# EAGLE design control board (EAGLE 9.6.0)
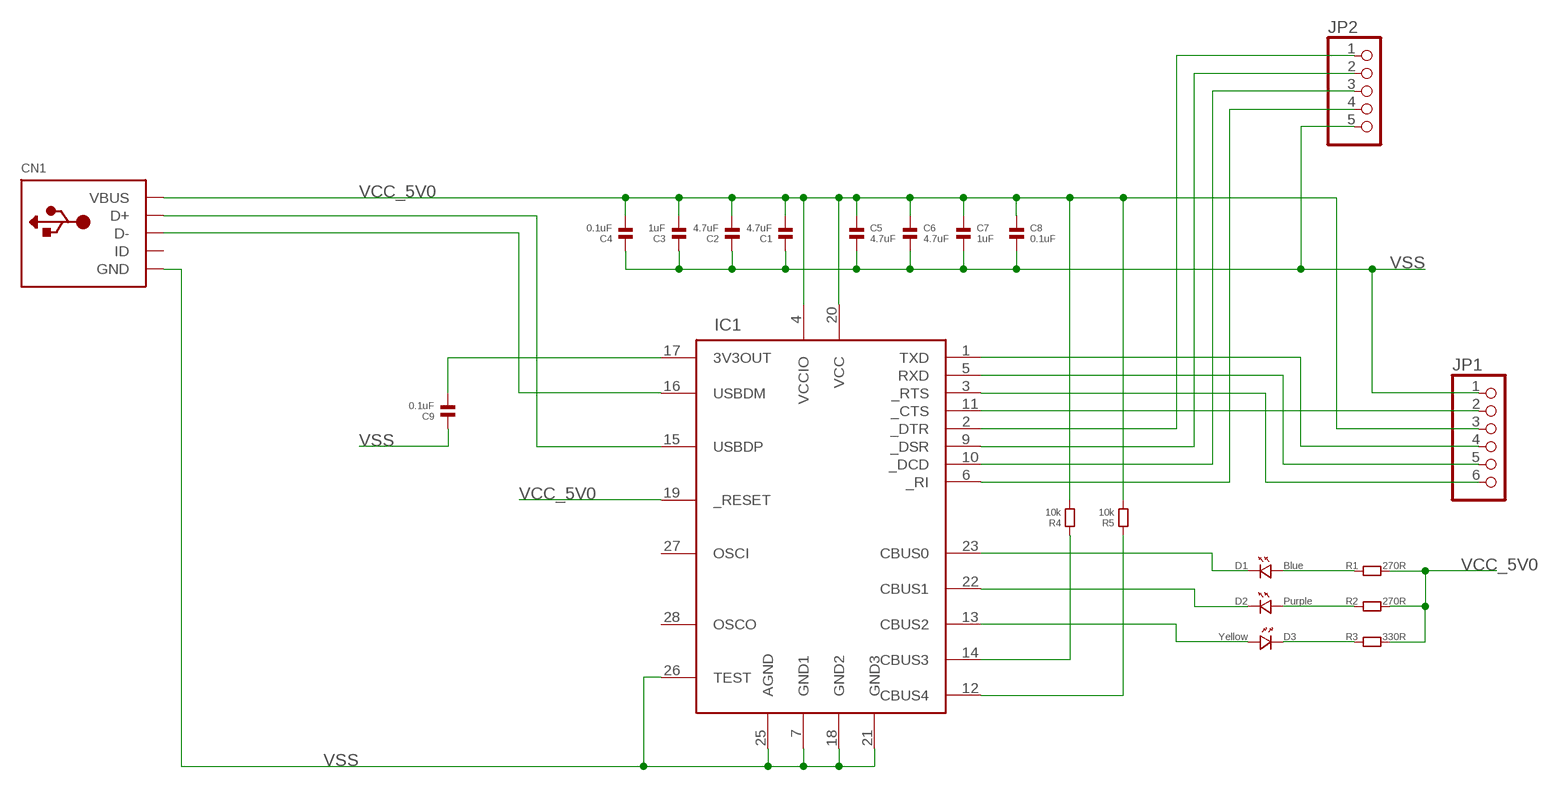
[diagram p0: schematic, sheet 1]

## Parts
C1  4.7uF  CAPACITOR.0603  [0603]
C2  4.7uF  CAPACITOR.0603  [0603]
C3  1uF  CAPACITOR.0603  [0603]
C4  0.1uF  CAPACITOR.0603  [0603]
C5  4.7uF  CAPACITOR.0603  [0603]
C6  4.7uF  CAPACITOR.0603  [0603]
C7  1uF  CAPACITOR.0603  [0603]
C8  0.1uF  CAPACITOR.0603  [0603]
C9  0.1uF  CAPACITOR.0603  [0603]
CN1  USBMINIB  [USB-MINIB]
D1  Blue  LED.0603  [0603.LED]
D2  Purple  LED.0603  [0603.LED]
D3  Yellow  LED.0603  [0603.LED]
IC1  FT232RL  [SSOP28DB]
JP1  PINHD-1X6  [1X06]
JP2  PINHD-1X5  [1X05]
R1  270R  RESISTOR.0603  [0603]
R2  270R  RESISTOR.0603  [0603]
R3  330R  RESISTOR.0603  [0603]
R4  10k  RESISTOR.0603  [0603]
R5  10k  RESISTOR.0603  [0603]

## Nets
N$1: CN1.D- IC1.16(USBDM)
N$2: CN1.D+ IC1.15(USBDP)
N$3: IC1.11(_CTS) JP1.2
N$4: IC1.1(TXD) JP1.4
N$5: IC1.5(RXD) JP1.5
N$6: IC1.3(_RTS) JP1.6
N$7: D1.P$2 IC1.23(CBUS0)
N$8: D2.P$2 IC1.22(CBUS1)
N$9: D2.P$1 R2.1
N$10: D1.P$1 R1.1
N$11: D3.P$1 IC1.13(CBUS2)
N$12: IC1.14(CBUS3) R4.1
N$13: IC1.12(CBUS4) R5.1
N$14: D3.P$2 R3.1
N$15: IC1.6(_RI) JP2.4
N$16: C9.2 IC1.17(3V3OUT)
N$17: IC1.10(_DCD) JP2.3
N$18: IC1.9(_DSR) JP2.2
N$19: IC1.2(_DTR) JP2.1
VCC_5V0: C1.2 C2.2 C3.2 C4.2 C5.1 C6.1 C7.1 C8.1 CN1.VBUS IC1.4(VCCIO) IC1.19(_RESET) IC1.20(VCC) JP1.3 R1.2 R2.2 R3.2 R4.2 R5.2
VSS: C1.1 C2.1 C3.1 C4.1 C5.2 C6.2 C7.2 C8.2 C9.1 CN1.GND IC1.7(GND1) IC1.18(GND2) IC1.21(GND3) IC1.25(AGND) IC1.26(TEST) JP1.1 JP2.5
Unconnected: CN1.ID IC1.27(OSCI) IC1.28(OSCO)

## Library data of the parts
C1-C9 = standardparts:CAPACITOR
CN1 = adafruit:USB: USB Connectors USBMINIB - Surface Mount Female Mini-B USB Connector 4UConnector: 06564 By microbuilder.eu Thru-hole RA Female Mini-B USB Connector 4UConnector: 18732 By ladyada.net
D1-D3 = standardparts:LED
IC1 = ftdichip-1:FT232RL: USB UART 4th Generation USB UART (USB <-> Serial) Controller
JP1 = pinhead:PINHD-1X6: PIN HEADER
JP2 = pinhead:PINHD-1X5: PIN HEADER
R1-R5 = standardparts:RESISTOR

## Board
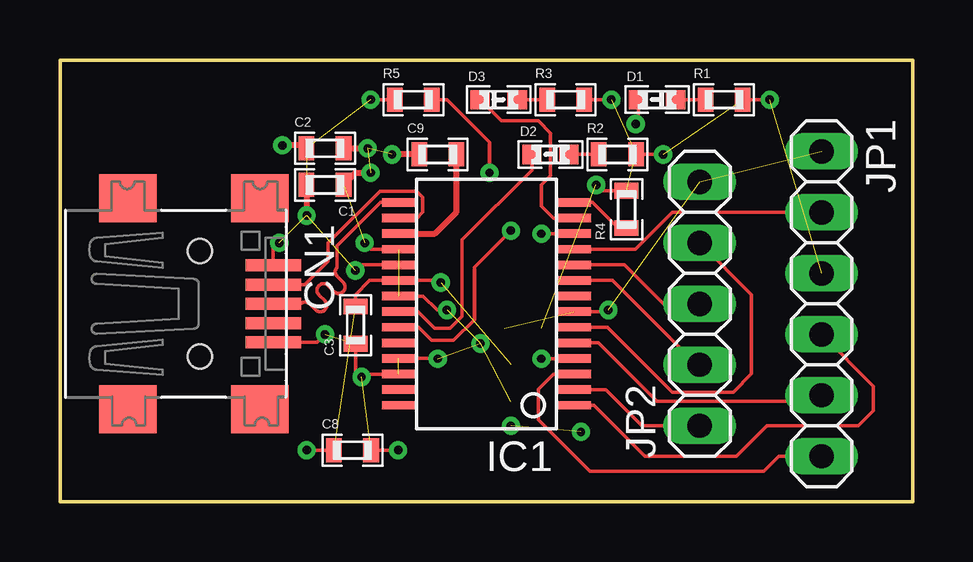
[diagram p1: board, top side]
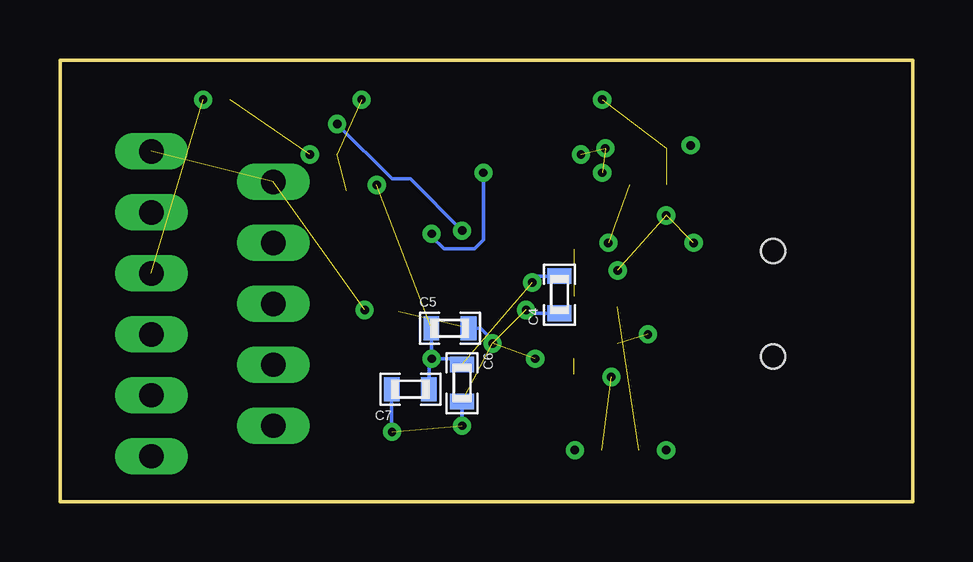
[diagram p2: board, bottom side, seen from below]

Size 35.56 x 18.41 mm. Coordinates in mm from the lower left corner, seen from the top.
Outline: 0,18.41 0,0 35.56,0 35.56,18.41 0,18.41
Copper layers (1*16): Top 0.035mm / dielectric 1.5mm / Bottom 0.035mm
Design rules "default": minimum track width 6mil, minimum drill 0.35mm, track to track 6mil, track to pad 6mil, pad to pad 6mil, via to via 6mil, smd to smd 6mil, copper to edge 40mil, drill to drill 6mil, minimum pad ring 10mil, minimum via ring 8mil, stop-mask expansion 4mil, vias tented up to drill 0mil, thermal gap 10mil

### Footprints (pad centres in the part's own frame; a part is rotated, then mirrored left to right if it is on the bottom)
0603 = smd 0.65 x 1: 1 -0.775,0; 2 0.775,0
USB-MINIB = smd 0.5 x 2.308: D+ 0,4.064; D- -0.8,4.064; GND 1.6,4.064; ID 0.8,4.064; VBUS -1.6,4.064 | smd 2 x 2.4: GND1 -4.4,-2; GND2 -4.4,3.5; GND3 4.4,3.5; GND4 4.4,-2 | hole 1: -2.2,1; 2.2,1
0603.LED = smd 0.8 x 0.8: P$1 -0.775,0; P$2 0.775,0
SSOP28DB = smd 0.348 x 1.397: 1 -4.225,-3.656; 2 -3.575,-3.656; 3 -2.925,-3.656; 4 -2.275,-3.656; 5 -1.625,-3.656; 6 -0.975,-3.656; 7 -0.325,-3.656; 8 0.325,-3.656; 9 0.975,-3.656; 10 1.625,-3.656; 11 2.275,-3.656; 12 2.925,-3.656; 13 3.575,-3.656; 14 4.225,-3.656; 15 4.225,3.656; 16 3.575,3.656; 17 2.925,3.656; 18 2.275,3.656; 19 1.625,3.656; 20 0.975,3.656; 21 0.325,3.656; 22 -0.325,3.656; 23 -0.975,3.656; 24 -1.625,3.656; 25 -2.275,3.656; 26 -2.925,3.656; 27 -3.575,3.656; 28 -4.225,3.656
1X06 = drill 1.016 long: 1 -6.35,0; 2 -3.81,0; 3 -1.27,0; 4 1.27,0; 5 3.81,0; 6 6.35,0
1X05 = drill 1.016 long: 1 -5.08,0; 2 -2.54,0; 3 0,0; 4 2.54,0; 5 5.08,0

### Placement (x,y rotation side)
C1  11.05,13.21 180 top
C2  11.05,14.73 180 top
C3  12.32,7.37 90 top
C4  14.73,8.64 90 bottom
C5  19.3,7.24 0 bottom
C6  18.8,4.95 270 bottom
C7  20.96,4.7 180 bottom
C8  12.19,2.16 0 top
C9  15.75,14.48 0 top
CN1  4.83,8.25 270 top
D1  24.89,16.76 180 top
D2  20.45,14.48 180 top
D3  18.29,16.76 0 top
IC1  17.78,8.25 90 top
JP1  31.75,8.25 270 top
JP2  26.67,8.25 90 top
R1  27.69,16.76 0 top
R2  23.24,14.48 0 top
R3  21.08,16.76 0 top
R4  23.62,12.19 90 top
R5  14.73,16.76 180 top

### Tracks (layer width: path | path; a pad name or v marks a point on that pad's centre or on a via)
N$1
  Top 0.152: CN1.D- 10.2,9.05 11.18,10.03 11.18,10.79 13.34,12.95 14.86,12.95 15.11,12.7 15.11,12.06 14.88,11.83 IC1.16
N$2
  Top 0.152: CN1.D+ 10.03,8.25 arc-90 10.41,8.25 10.66,8 arc90 11.04,8 11.05,8 arc90 11.05,8.38 10.79,8.64 arc-90 10.79,9.01 10.8,9.02 arc-90 11.17,9.02 11.43,8.76 arc90 11.8,8.76 11.81,8.77 arc90 11.81,9.14 11.55,9.4 arc-90 11.55,9.78 11.56,9.78 11.56,10.67 13.37,12.48 IC1.15
N$3
  Top 0.152: IC1.11 23.99,10.53 25.53,12.06 JP1.2
N$4
  Top 0.152: IC1.1 22.26,4.03 24.38,1.9 28.19,1.9 29.46,3.17 33.27,3.17 33.91,3.81 33.91,4.83 JP1.4
N$5
  Top 0.152: IC1.5 22.45,6.63 24.89,4.19 31.5,4.19 JP1.5
N$6
  Top 0.152: IC1.3 20.57,5.33 19.94,4.7 19.94,3.43 22.1,1.27 29.34,1.27 29.97,1.9 JP1.6
N$7  (via drill 0.35)
  Top 0.152: IC1.23 14.95,7.28 15.49,6.73 16.41,6.73 17.27,7.59 17.27,9.78 v18.8,11.3 | D1.P$2 24.12,15.86 v24,15.75
  Bottom 0.152: v18.8,11.3 20.96,13.46 21.72,13.46 v24,15.75
N$8
  Top 0.152: IC1.22 14.93,7.93 15.62,7.24 16.26,7.24 16.76,7.75 16.76,10.92 19.67,13.83 D2.P$2
N$9
  Top 0.152: D2.P$1 R2.1
N$10
  Top 0.152: R1.1 D1.P$1
N$11
  Top 0.152: D3.P$1 18.4,15.88 19.94,15.88 20.45,15.37 20.45,13.59 20.07,13.21 20.07,12.32 20.57,11.81 21.42,11.81 IC1.13
N$12
  Top 0.152: IC1.14 22.19,12.48 23.25,11.42 R4.1
N$13  (via drill 0.35)
  Top 0.152: R5.1 16.13,16.76 17.91,14.99 v17.91,13.72 | IC1.12 v20.07,11.18
  Bottom 0.152: v17.91,13.72 17.91,10.92 18.29,10.54 19.56,10.54 20.07,11.05 v20.07,11.18
N$14
  Top 0.152: R3.1 D3.P$2
N$15
  Top 0.152: IC1.6 22.82,7.28 25.53,4.57 28.07,4.57 28.83,5.33 28.83,8.64 JP2.4
N$16
  Top 0.254: IC1.17 15.63,11.18 16.52,12.08 C9.2
N$17
  Top 0.152: IC1.10 23.52,9.88 25.15,8.25 JP2.3
N$18
  Top 0.152: IC1.9 23.03,9.23 26.54,5.71 JP2.2
N$19
  Top 0.152: IC1.2 22.75,4.68 24.26,3.17 JP2.1
VCC_5V0  (via drill 0.35)  (12 unrouted)
  Top 0.152: CN1.VBUS 8.89,10.54 v9.14,10.79 | IC1.4 21.43,5.97 v20.07,5.97 | v15.88,9.14 15.79,9.23 IC1.20 12.91,9.23 12.32,8.64 C3.2 | C8.1 v10.29,2.16 | IC1.19 12.55,9.88 v12.31,9.64 | R2.2 v25.15,14.48 | R1.2 v29.59,16.76 | R3.2 v22.99,16.76 | R4.2 22.59,12.97 v22.35,13.21 | R5.2 v12.95,16.76
  Top 0.254: C2.2 10.15,14.86 v9.27,14.86 | C1.2 10.27,11.95 v10.29,11.94
  Bottom 0.152: C4.2 15.61,9.41 v15.88,9.14 | C5.1 20.08,5.98 v20.07,5.97 | C6.1 19.04,5.97 v20.07,5.97 | C7.1 20.18,5.85 v20.07,5.97
VSS  (via drill 0.35)  (14 unrouted)
  Top 0.152: CN1.GND 10.72,6.65 v11.05,6.98 | IC1.7 22.79,7.93 v22.86,8 | IC1.26 12.7,5.33 v12.57,5.21 12.32,5.46 C3.1 | IC1.25 15.74,5.98 v15.75,5.97 | v16.13,8 15.72,8 15.14,8.58 IC1.21 | C8.2 v14.1,2.16 | IC1.18 12.97,10.53 v12.7,10.79
  Top 0.254: C9.1 v13.84,14.48 | C1.1 12.33,13.72 v12.95,13.72 | C2.1 v12.83,14.73
  Bottom 0.152: C4.1 15.99,7.86 v16.13,8 | C5.2 18.02,7.24 17.53,6.74 v17.53,6.6 | C6.2 v18.8,3.17 | C7.2 v21.73,2.93 v21.72,2.92